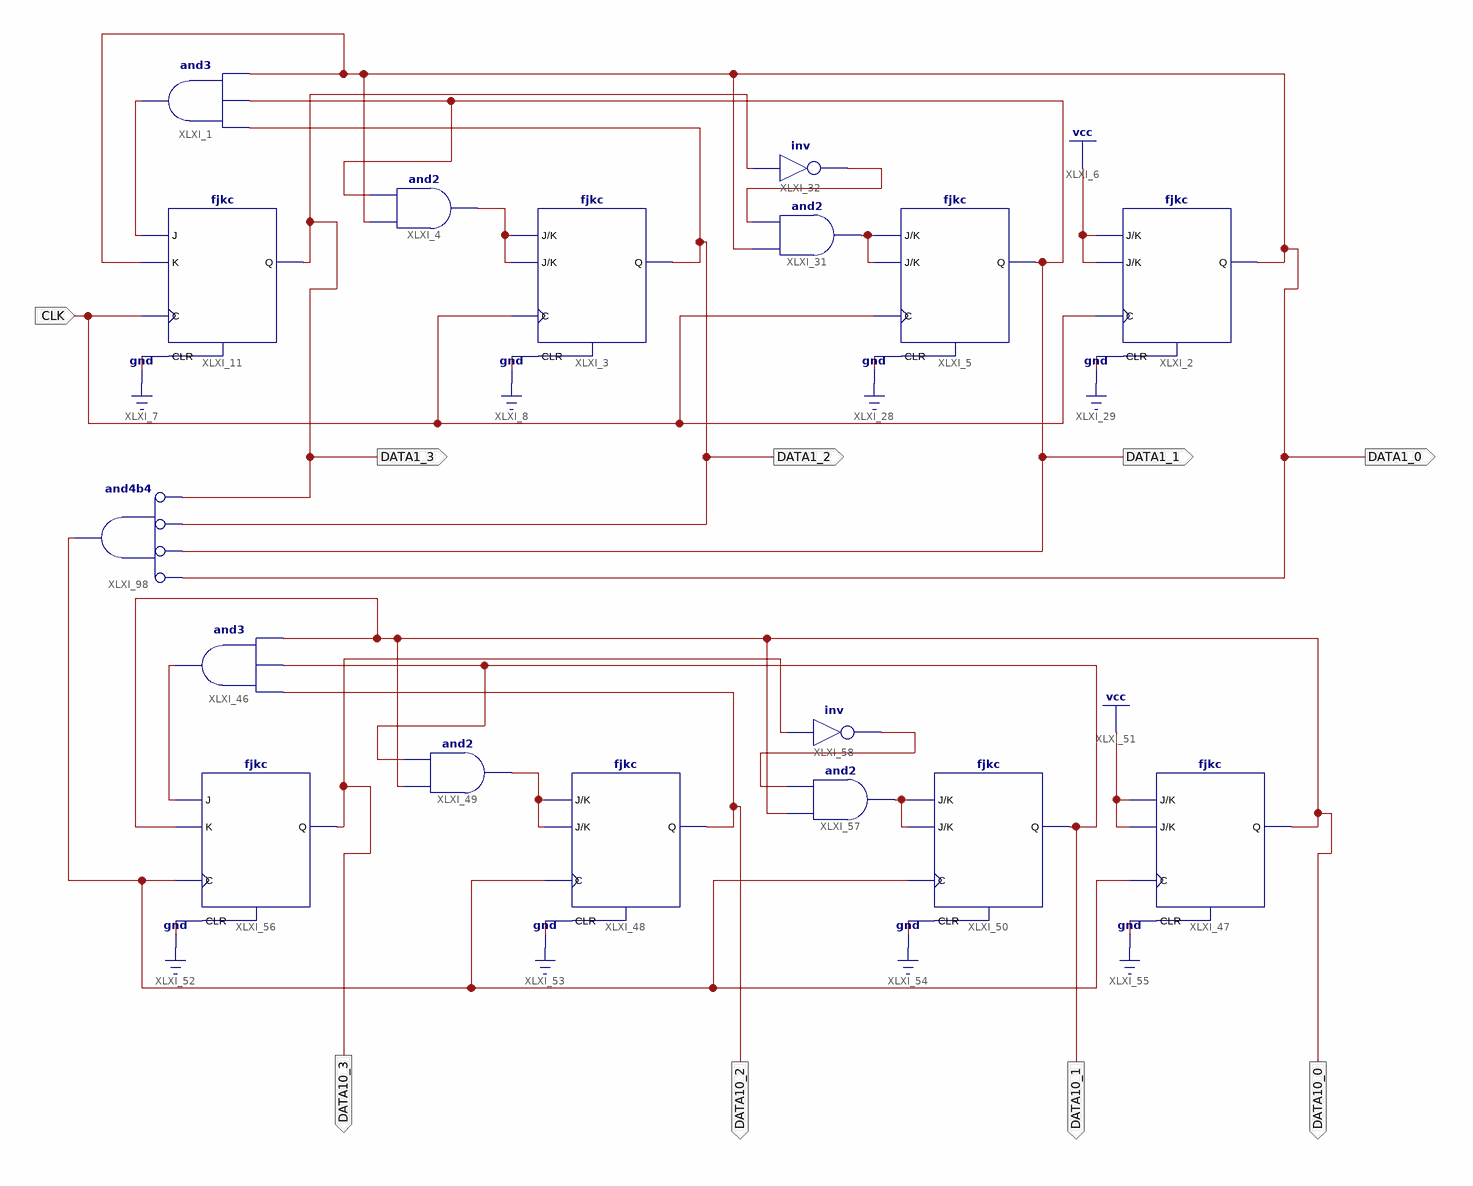
[diagram p0: schematic sheet 1]
// Xilinx ISE schematic Counter.sch (spartan6) as structural Verilog: 17 symbols, 9 ports
module Counter (
  input  CLK,
  output DATA1_3,
  output DATA1_2,
  output DATA1_1,
  output DATA1_0,
  output DATA10_3,
  output DATA10_2,
  output DATA10_1,
  output DATA10_0
);

  wire XLXN_1, XLXN_14, XLXN_74, XLXN_76, XLXN_98, XLXN_109, XLXN_114, XLXN_117, XLXN_178;

  and XLXI_1 (XLXN_14, DATA1_2, DATA1_1, DATA1_0);
  fjkc XLXI_2 (.C(CLK), .CLR(1'b0), .J(1'b1), .K(1'b1), .Q(DATA1_0));
  fjkc XLXI_3 (.C(CLK), .CLR(1'b0), .J(XLXN_1), .K(XLXN_1), .Q(DATA1_2));
  and XLXI_4 (XLXN_1, DATA1_0, DATA1_1);
  fjkc XLXI_5 (.C(CLK), .CLR(1'b0), .J(XLXN_76), .K(XLXN_76), .Q(DATA1_1));
  fjkc XLXI_11 (.C(CLK), .CLR(1'b0), .J(XLXN_14), .K(DATA1_0), .Q(DATA1_3));
  and XLXI_31 (XLXN_76, DATA1_0, XLXN_74);
  not XLXI_32 (XLXN_74, DATA1_3);
  and XLXI_46 (XLXN_109, DATA10_2, DATA10_1, DATA10_0);
  fjkc XLXI_47 (.C(XLXN_178), .CLR(1'b0), .J(1'b1), .K(1'b1), .Q(DATA10_0));
  fjkc XLXI_48 (.C(XLXN_178), .CLR(1'b0), .J(XLXN_98), .K(XLXN_98), .Q(DATA10_2));
  and XLXI_49 (XLXN_98, DATA10_0, DATA10_1);
  fjkc XLXI_50 (.C(XLXN_178), .CLR(1'b0), .J(XLXN_117), .K(XLXN_117), .Q(DATA10_1));
  fjkc XLXI_56 (.C(XLXN_178), .CLR(1'b0), .J(XLXN_109), .K(DATA10_0), .Q(DATA10_3));
  and XLXI_57 (XLXN_117, DATA10_0, XLXN_114);
  not XLXI_58 (XLXN_114, DATA10_3);
  and XLXI_98 (XLXN_178, ~DATA1_0, ~DATA1_1, ~DATA1_2, ~DATA1_3);  // and4b4
endmodule
